# EAGLE design overpoweredRedLight (EAGLE 9.6.2)
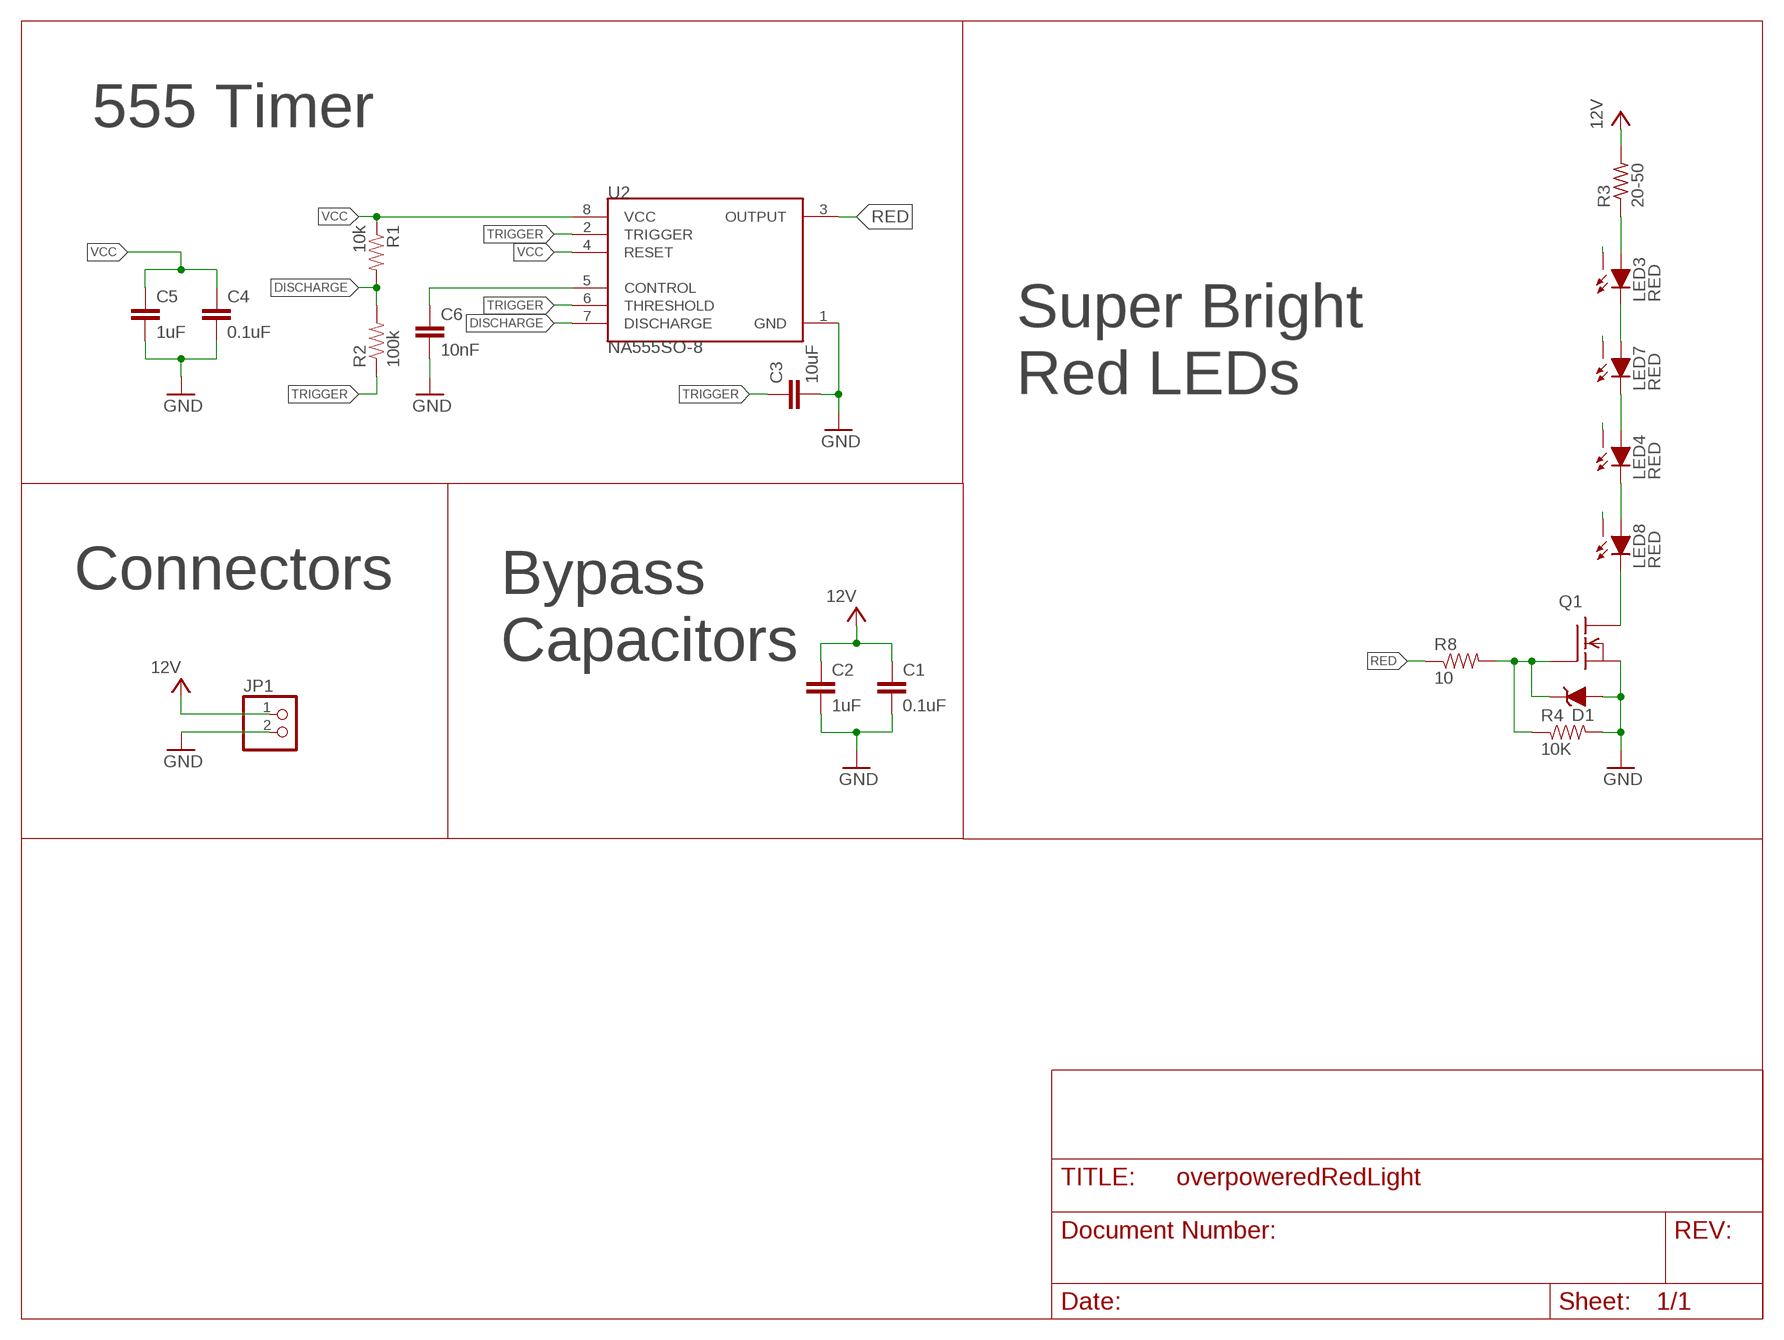
[diagram p0: schematic, sheet 1]

## Parts
C1  0.1uF  CAP0603-CAP  [0603-CAP]
C2  1uF  CAP0603-CAP  [0603-CAP]
C3  10uF  CAP0603-CAP  [0603-CAP]
C4  0.1uF  CAP0603-CAP  [0603-CAP]
C5  1uF  CAP0603-CAP  [0603-CAP]
C6  10nF  CAP0603-CAP  [0603-CAP]
D1  MMBZ5246BLT1G  DIODE_ZENER  [SOT23]
JP1  PINHD-1X2  [1X02]
LED3  RED  XP-E2XP-E2  [XP-E2]
LED4  RED  XP-E2XP-E2  [XP-E2]
LED7  RED  XP-E2XP-E2  [XP-E2]
LED8  RED  XP-E2XP-E2  [XP-E2]
Q1  DMG3406LSOT  [SOT23]
R1  10k  RESISTOR0603-RES  [0603-RES]
R2  100k  RESISTOR0603-RES  [0603-RES]
R3  20-50  RES_AXIAL1W-0.6  [1W-0.6]
R4  10K  RESISTOR0603-RES  [0603-RES]
R8  10  RESISTOR0603-RES  [0603-RES]
U2  NA555SO-8  [SOIC-08]

## Nets
DISCHARGE: R1.2 R2.2 U2.7(DISCHARGE)
GND: C1.2 C2.2 C3.2 C4.2 C5.2 C6.2 D1.1(A) JP1.2 Q1.2(S) R4.2 U2.1(GND)
N$4: D1.3(C) Q1.1(G) R4.1 R8.2
N$10: LED8.C Q1.3(D)
N$11: LED3.A R3.1
N$13: C6.1 U2.5(CONTROL)
N$17: LED3.C LED7.A
N$18: LED4.A LED7.C
N$19: LED4.C LED8.A
RED: R8.1 U2.3(OUTPUT)
THERM1: LED4.X LED8.X
THERM2: LED3.X LED7.X
TRIGGER: C3.1 R2.1 U2.2(TRIGGER) U2.6(THRESHOLD)
VCC: C1.1 C2.1 C4.1 C5.1 JP1.1 R1.1 R3.2 U2.4(RESET) U2.8(VCC) ; supply symbol labelled 12V

## Notes on the sheet
- 555 Timer
- Super Bright 
  Red LEDs
- Connectors
- Bypass 
  Capacitors

## Library data of the parts
C1-C6 = HyTechDevices:CAP: Capacitor Standard 0603 ceramic capacitor, and 0.1" leaded capacitor.; TOLERANCE: 5%; VOLTAGE: 25V
D1 = HyTechDevices:DIODE_ZENER: ZENER DIODE
JP1 = GTOR - Connectors:PINHD-1X2: PIN HEADER
LED3 LED4 LED7 LED8 = HyTechDevices:XP-E2: XP-E2 high-brightness LED. Data sheet <https://www.cree.com/led-components/media/documents/XLampXPE2.pdf>
Q1 = HyTechDevices:DMG3406L: Generic NPN MOSFET DMG3406L (SOT-23, 2.8 A 30V)
R1 R2 R4 R8 = HyTechDevices:RESISTOR: Resistor Basic schematic elements and footprints for 0603, 1206, and PTH resistors.; TOLERANCE: 1%
R3 = GTOR - Passive Components:RES_AXIAL: RESISTOR, American symbol; SPICEPREFIX: R
U2 = HyTechDevices:NA555: Texas Instruments NA555 timer. Data sheet <http://www.ti.com/lit/ds/symlink/se555.pdf>

## Board
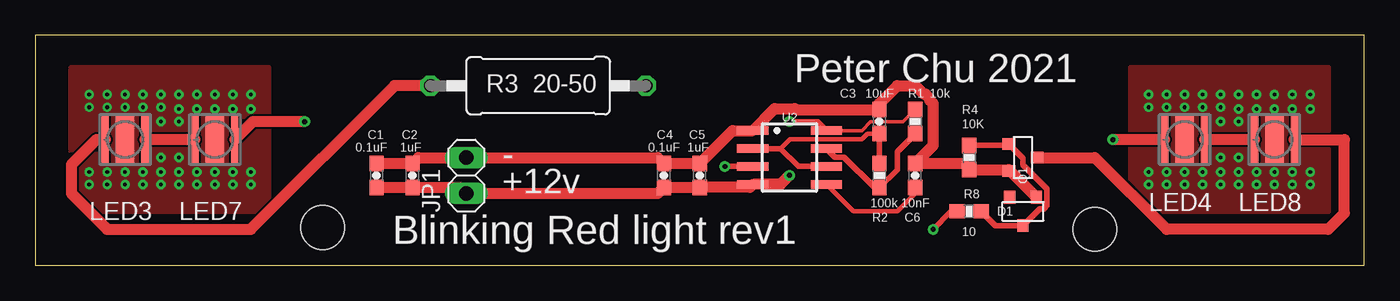
[diagram p1: board, top side]
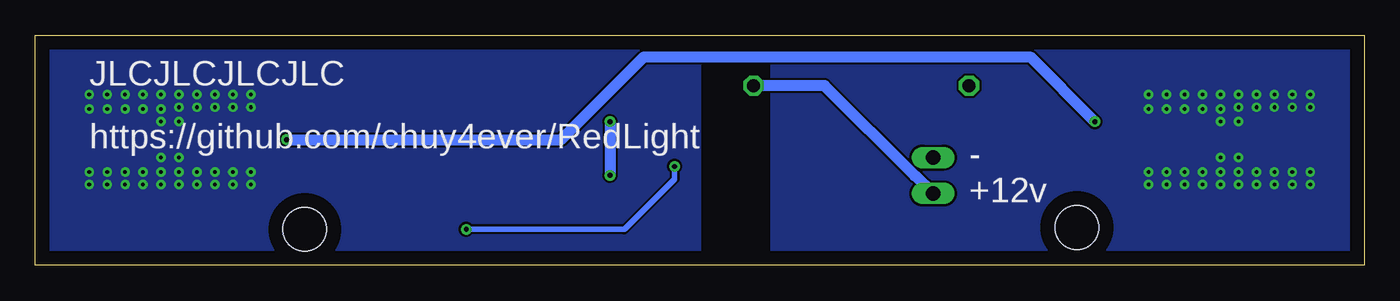
[diagram p2: board, bottom side, seen from below]

Size 93.98 x 16.26 mm. Coordinates in mm from the lower left corner, seen from the top.
Outline: 0,0 93.98,0 93.98,16.26 0,16.26 0,0
Copper layers (1*16): Top 0.035mm / dielectric 1.5mm / Bottom 0.035mm
Design rules "default *": minimum track width 6mil, minimum drill 10mil, track to track 6mil, track to pad 6mil, pad to pad 6mil, via to via 6mil, smd to smd 6mil, copper to edge 40mil, drill to drill 6mil, minimum pad ring 10mil, minimum via ring 8mil, stop-mask expansion 4mil, vias tented up to drill 0mil, thermal gap 10mil
Holes 3.1 mm at 20.32,2.67 74.93,2.54

### Footprints (pad centres in the part's own frame; a part is rotated, then mirrored left to right if it is on the bottom)
0603-CAP = smd 1.1 x 1: 1 -0.85,0; 2 0.85,0
SOT23 = smd 0.8 x 0.9: 1 -0.95,-1; 2 0.95,-1; 3 0,1
1X02 = drill 1.016 long: 1 -1.27,0; 2 1.27,0
XP-E2 = smd 0.5 x 3.3: A -1.4,0; C 1.4,0 | smd 1.3 x 3.3: X 0,0
0603-RES = smd 1.1 x 1: 1 -0.85,0; 2 0.85,0
1W-0.6 = drill 0.914 octagon: 1 -7.62,0; 2 7.62,0
SOIC-08 = smd 0.6 x 2.2: 1 -1.905,-2.6; 2 -0.635,-2.6; 3 0.635,-2.6; 4 1.905,-2.6; 5 1.905,2.6; 6 0.635,2.6; 7 -0.635,2.6; 8 -1.905,2.6

### Placement (x,y rotation side)
C1  24.13,6.35 90 top
C2  26.67,6.35 90 top
C3  59.69,10.16 90 top
C4  44.45,6.35 90 top
C5  46.99,6.35 90 top
C6  62.23,6.35 90 top
D1  69.85,3.81 180 top
JP1  30.48,6.35 90 top
LED3  6.35,8.89 0 top
LED4  81.28,8.89 0 top
LED7  12.7,8.89 0 top
LED8  87.63,8.89 0 top
Q1  69.85,7.62 270 top
R1  62.23,10.16 270 top
R2  59.69,6.35 270 top
R3  35.56,12.7 0 top
R4  66.04,7.62 270 top
R8  66.04,3.81 0 top
U2  53.34,7.62 270 top

### Tracks (layer width: path | path; a pad name or v marks a point on that pad's centre or on a via)
DISCHARGE
  Top 0.406: U2.7 56.55,7.64 57.19,7.64 59.33,5.5 R2.2 60.96,6.77 60.96,8.04 R1.2
GND
  Top 0.406: 63.5,11.43 62.23,12.7 | R4.2 68.75,6.77 Q1.2 70.71,4.81 D1.1
  Top 0.762: C1.2 C2.2 27.09,7.62 JP1.2 44.03,7.62 C4.2 C5.2 49.31,9.53 U2.1 52.29,11.07 53.72,11.07 53.78,11.01 C3.2 59.69,11.43 60.96,12.7 62.23,12.7 62.84,12.09 62.95,12.09 63.26,11.78 63.26,11.67 63.5,11.43 63.5,8.47 C6.2 65.61,7.2 R4.2 68.84,6.77 D1.1
N$4
  Top 0.406: R4.1 68.75,8.47 Q1.1 69.85,7.57 69.85,7.11 71.56,5.41 71.56,4.21 71.35,4 71.04,4 D1.3 67.89,2.81 R8.2
N$10
  Top 0.406: 91.44,2.54 92.71,3.81 92.71,8.89 92.58,8.89
  Top 0.762: Q1.3 74.93,7.62 80.01,2.54 91.44,2.54 92.58,3.68 92.58,8.89 LED8.C
N$11
  Top 0.762: LED3.A 4.32,8.89 2.54,7.12 2.54,5.08 5.08,2.54 15.24,2.54 25.4,12.7 R3.1
N$13
  Top 0.305: U2.5 57.84,3.81 60.96,3.81 62.23,5.08 C6.1
N$17
  Top 0.762: LED7.A LED3.C
N$18  (via drill 0.35)
  Top 0.762: LED4.A v76.2,8.89 | v19.05,10.16 15.37,10.16 LED7.C
  Bottom 0.762: v76.2,8.89 56.79,8.89 50.95,14.73 23.62,14.73 v19.05,10.16
N$19
  Top 0.762: LED8.A LED4.C
RED  (via drill 0.35)
  Top 0.406: U2.3 v48.77,6.99 | v63.5,2.54 64.77,3.81 R8.1
  Bottom 0.406: v48.77,6.99 48.77,6.1 52.32,2.54 v63.5,2.54
THERM1  (via drill 0.25)
  other vias: 87.63,5.71 78.74,11.18 78.74,12.06 80.01,12.06 81.28,12.06 82.55,12.06 83.82,12.06 85.09,12.06 86.36,12.06 87.63,12.06 88.9,12.06 90.17,12.06 90.17,5.71 88.9,5.71 86.36,5.71 85.09,5.71 83.82,5.71 82.55,5.71 81.28,5.71 80.01,5.71 78.74,5.71 83.82,7.62 85.09,7.62 83.82,10.16 85.09,10.16 83.82,11.18 82.55,11.18 81.28,11.18 80.01,11.18 83.82,6.6 82.55,6.6 81.28,6.6 80.01,6.6 78.74,6.6 90.17,11.05 88.9,11.05 87.63,11.05 86.36,11.05 85.09,11.05 90.17,6.6 88.9,6.6 87.63,6.6 86.36,6.6 85.09,6.6
  pour Top (no thermals): 77.47,13.97 77.47,3.81 91.44,3.81 91.44,13.97
  pour Bottom (no thermals): 46.99,30.48 46.99,-10.16 100.33,-10.16 100.33,31.75 99.06,33.02 49.53,33.02
THERM2  (via drill 0.25)
  other vias: 12.7,5.71 3.81,11.18 3.81,12.06 5.08,12.06 6.35,12.06 7.62,12.06 8.89,12.06 10.16,12.06 11.43,12.06 12.7,12.06 13.97,12.06 15.24,12.06 15.24,5.71 13.97,5.71 11.43,5.71 10.16,5.71 8.89,5.71 7.62,5.71 6.35,5.71 5.08,5.71 3.81,5.71 8.89,7.62 10.16,7.62 8.89,10.16 10.16,10.16 8.89,11.18 7.62,11.18 6.35,11.18 5.08,11.18 8.89,6.6 7.62,6.6 6.35,6.6 5.08,6.6 3.81,6.6 15.24,11.05 13.97,11.05 12.7,11.05 11.43,11.05 10.16,11.05 15.24,6.6 13.97,6.6 12.7,6.6 11.43,6.6 10.16,6.6
  pour Top (no thermals): 2.54,13.97 2.54,3.81 16.51,3.81 16.51,13.97
  pour Bottom (no thermals): -7.62,30.48 -7.62,-10.16 40.64,-10.16 41.91,-8.89 41.91,29.21 41.91,30.48
TRIGGER
  Top 0.305: C3.1 58.86,9.31 58.47,8.92 53.37,8.92 52.7,8.26
  Top 0.406: C3.1 R2.1 | U2.2 52.7,8.26 53.98,6.99 U2.6
VCC  (via drill 0.35)
  Top 0.254: U2.8 58.46,9.53 59.07,10.14 61.36,10.14 R1.1
  Top 0.406: 50.8,5.71 U2.4 | v53.34,10.16 55.3,10.16 U2.8
  Top 0.762: C1.1 C2.1 30.06,5.5 JP1.1 44.03,5.08 C4.1 C5.1 50.52,5.5 U2.4 | v53.34,6.35 52.7,5.71 50.8,5.71
  Bottom 0.762: JP1.1 31.73,6.33 31.78,6.33 38.15,12.7 R3.2 | v53.34,10.16 v53.34,6.35

### Text on the board
tNames: Peter Chu 2021 | - | +12v | Blinking Red light rev1
bNames: JLCJLCJLCJLC | https://github.com/chuy4ever/RedLight | - | +12v